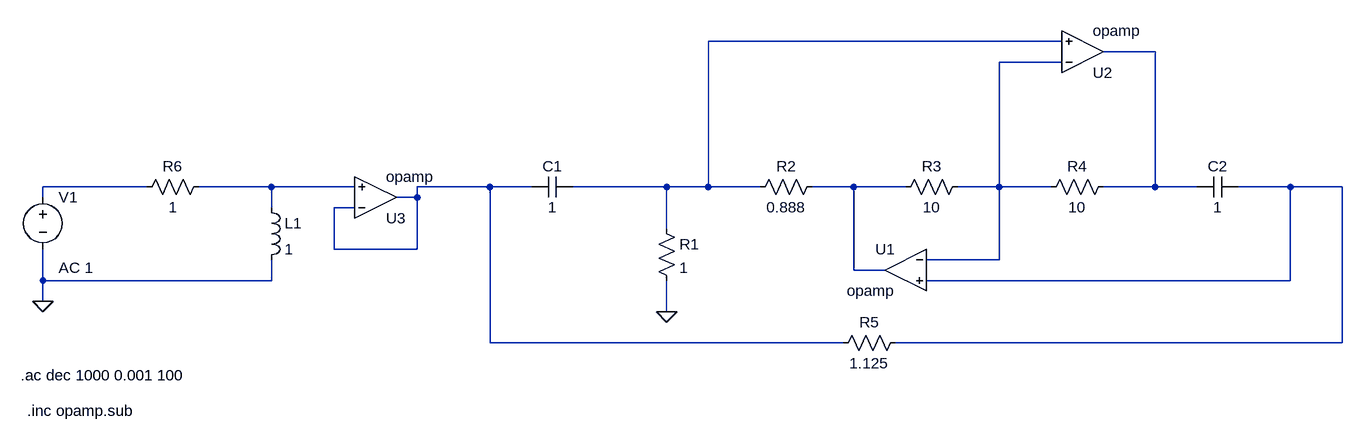
[diagram p0: schematic GIC.asc]
GIC.asc, the LTspice schematic file:
Version 4
SHEET 1 1140 680
WIRE 704 -64 160 -64
WIRE 848 -48 768 -48
WIRE 704 -32 608 -32
WIRE -704 160 -864 160
WIRE -512 160 -624 160
WIRE -384 160 -512 160
WIRE -176 160 -288 160
WIRE -112 160 -176 160
WIRE 96 160 -48 160
WIRE 160 160 160 -64
WIRE 160 160 96 160
WIRE 240 160 160 160
WIRE 384 160 320 160
WIRE 464 160 384 160
WIRE 608 160 608 -32
WIRE 608 160 544 160
WIRE 688 160 608 160
WIRE 848 160 848 -48
WIRE 848 160 768 160
WIRE 912 160 848 160
WIRE 1056 160 976 160
WIRE 1136 160 1056 160
WIRE -864 176 -864 160
WIRE -288 176 -288 160
WIRE -288 176 -320 176
WIRE -512 192 -512 160
WIRE -384 192 -416 192
WIRE 96 224 96 160
WIRE -416 256 -416 192
WIRE -288 256 -288 176
WIRE -288 256 -416 256
WIRE 608 272 608 160
WIRE 608 272 496 272
WIRE 384 288 384 160
WIRE 432 288 384 288
WIRE -864 304 -864 256
WIRE -512 304 -512 272
WIRE -512 304 -864 304
WIRE 1056 304 1056 160
WIRE 1056 304 496 304
WIRE -864 336 -864 304
WIRE 96 352 96 304
WIRE -176 400 -176 160
WIRE 368 400 -176 400
WIRE 1136 400 1136 160
WIRE 1136 400 448 400
FLAG 96 352 0
FLAG -864 336 0
SYMBOL res 80 208 R0
SYMATTR InstName R1
SYMATTR Value 1
SYMBOL res 336 144 R90
WINDOW 0 0 56 VBottom 2
WINDOW 3 32 56 VTop 2
SYMATTR InstName R2
SYMATTR Value 0.888
SYMBOL res 560 144 R90
WINDOW 0 0 56 VBottom 2
WINDOW 3 32 56 VTop 2
SYMATTR InstName R3
SYMATTR Value 10
SYMBOL res 784 144 R90
WINDOW 0 0 56 VBottom 2
WINDOW 3 32 56 VTop 2
SYMATTR InstName R4
SYMATTR Value 10
SYMBOL res 464 384 R90
WINDOW 0 0 56 VBottom 2
WINDOW 3 32 56 VTop 2
SYMATTR InstName R5
SYMATTR Value 1.125
SYMBOL cap -48 144 R90
WINDOW 0 0 32 VBottom 2
WINDOW 3 32 32 VTop 2
SYMATTR InstName C1
SYMATTR Value 1
SYMBOL cap 976 144 R90
WINDOW 0 0 32 VBottom 2
WINDOW 3 32 32 VTop 2
SYMATTR InstName C2
SYMATTR Value 1
SYMBOL voltage -864 160 R0
WINDOW 123 24 124 Left 2
WINDOW 39 0 0 Left 0
SYMATTR InstName V1
SYMATTR Value ""
SYMATTR Value2 AC 1
SYMBOL OpAmps\\opamp 464 224 M0
SYMATTR InstName U1
SYMBOL OpAmps\\opamp 736 16 M180
SYMATTR InstName U2
SYMBOL res -608 144 R90
WINDOW 0 0 56 VBottom 2
WINDOW 3 32 56 VTop 2
SYMATTR InstName R6
SYMATTR Value 1
SYMBOL ind -528 176 R0
SYMATTR InstName L1
SYMATTR Value 1
SYMBOL OpAmps\\opamp -352 240 M180
SYMATTR InstName U3
TEXT -898 450 Left 2 !.ac dec 1000 0.001 100
TEXT -888 504 Left 2 !.inc opamp.sub

The netlist it stands for:
* GIC.asc
R1 N001 0 1
R2 N007 N001 0.888
R3 N003 N007 10
R4 N002 N003 10
R5 N008 N006 1.125
C1 N001 N006 1
C2 N008 N002 1
V1 N004 0 AC 1
XU1 N003 N008 N007 opamp Aol=100K GBW=10Meg  ; pins invin noninvin out
XU2 N003 N001 N002 opamp Aol=100K GBW=10Meg  ; pins invin noninvin out
R6 N005 N004 1
L1 N005 0 1
XU3 N006 N005 N006 opamp Aol=100K GBW=10Meg  ; pins invin noninvin out
.ac dec 1000 0.001 100
.inc opamp.sub
.backanno
.end